# Altium project MCU052A.PrjPcb
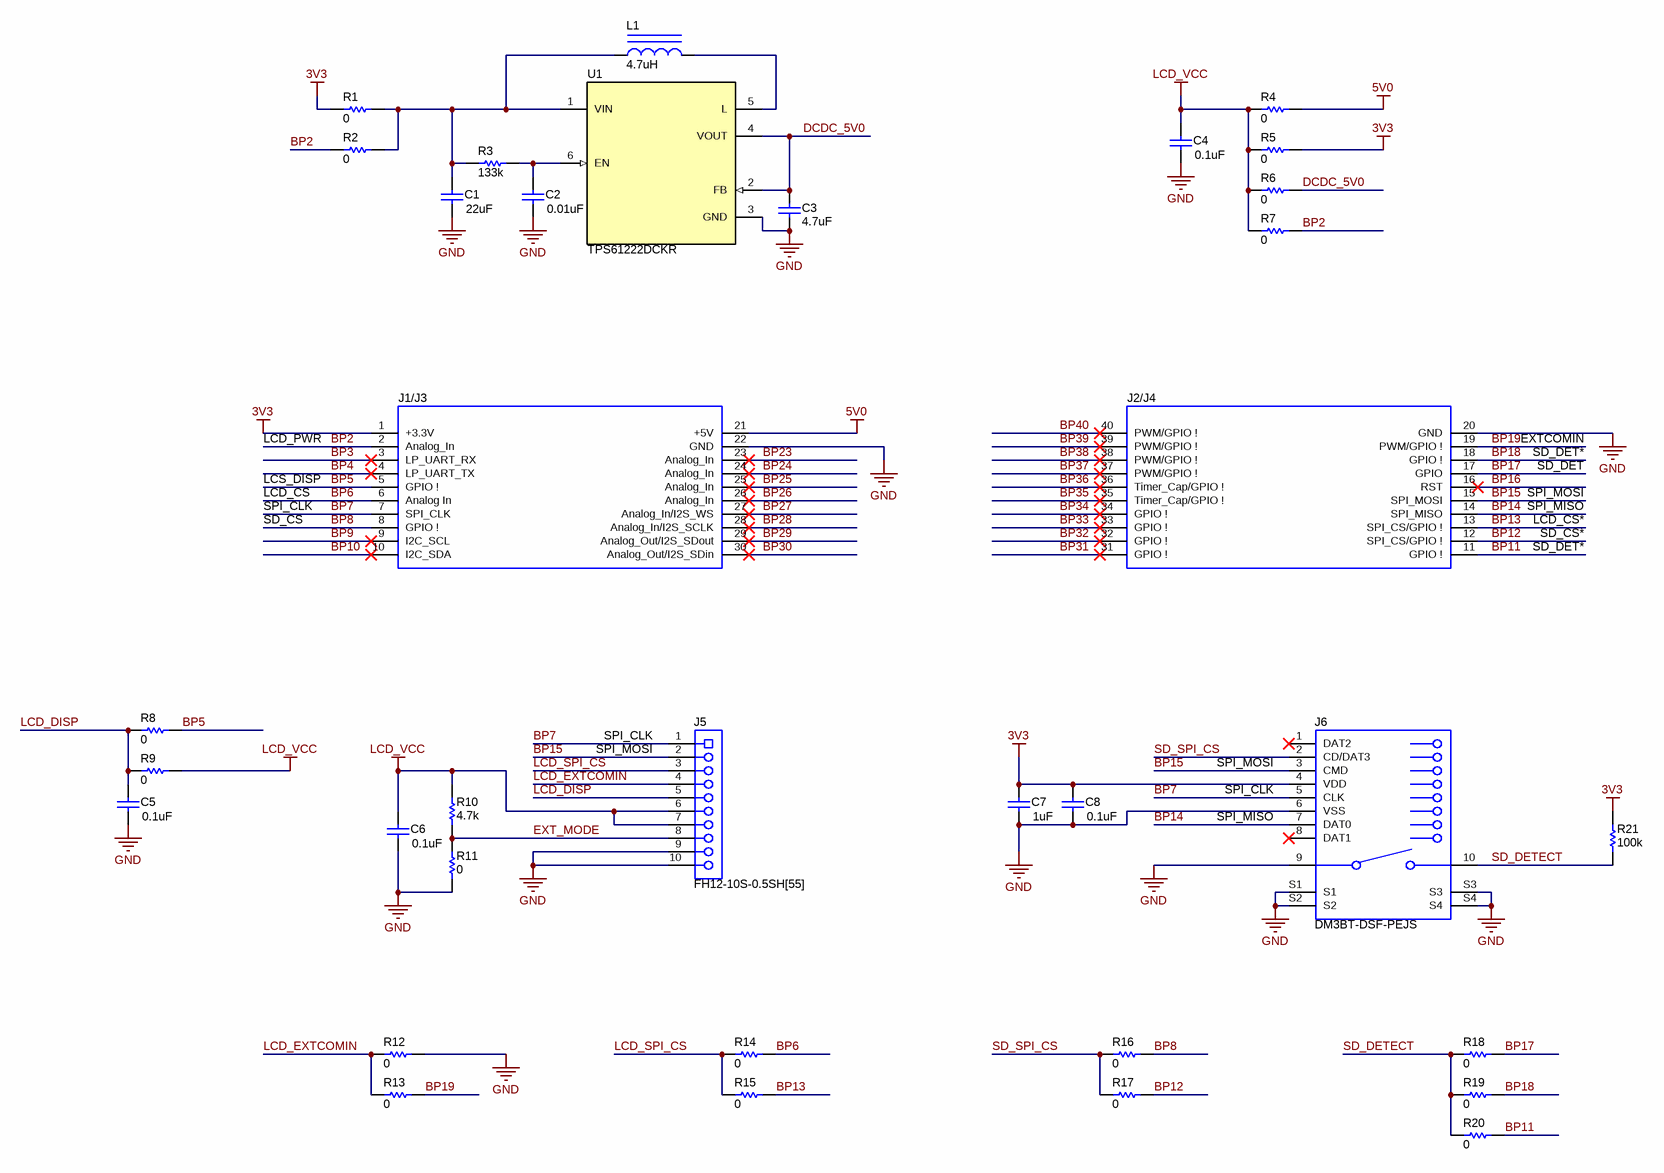
[diagram p0: MCU052A_BOOSTXL-SHARP128.SchDoc]
CopyrightYear: 2018; PCB_Layout: Eric Chen; PCB_Rev: A; PRJ_Customer: Public Release; PRJ_Engineer: Eric Chen; PRJ_Number: MCU052; PRJ_Title: BOOSTXL-SHARP128; SCH_Rev: A; TechSupport: http://www.ti.com/support; TID: N/A
2 sheets, 51 parts. Net scope: global (net labels, ports and power ports of the same name join across sheets).
Board file: MCU052A_PCB.PcbDoc
Sheets:
  MCU052A_BOOSTXL-SHARP128.SchDoc
  MCU052A_EVM_Hardware.SchDoc

## Sheet MCU052A_BOOSTXL-SHARP128.SchDoc
size 431 x 279 mm; Date: Not shown in title block; ApprovedBy: Not shown in title block; CheckedBy: Not shown in title block; Author: Not shown in title block; CompanyName: Not shown in title block; Engineer: Not shown in title block; Organization: Not shown in title block; Address1: Not shown in title block; Address2: Not shown in title block; Address3: Not shown in title block; Address4: Not shown in title block; DocumentNumber: 1; Revision: Use project parameter SCH_Rev; SheetNumber: 1; SheetTotal: 2; PageSetup: Record=PageOptions|CenterHorizontal=True|CenterVertical=True|PrintScale=1.00|XCorrection=1.00|YCorrection=1.00|PrintKind=0|BorderSize=5000000|LeftOffset=0|BottomOffset=0|Orientation=2|PaperLength=1000|PaperWidth=1000|Scale=100|PaperSource=15|PrintQuality=600|MediaType=1|DitherType=10|PaperKind=Letter|PrintScaleMode=1; CurrentTime: Not shown in title block; CurrentDate: Not shown in title block; Time: Not shown in title block; DocumentFullPathAndName: Not shown in title block; DocumentName: Not shown in title block; ModifiedDate: Not shown in title block; ImagePath: Not shown in title block

### Parts
C1  ValueDisplayed: 22uF  [0603]  (hidden comment: GRM188R61A226ME15D)
C2  ValueDisplayed: 0.01uF  [0603]  (hidden comment: GRM188R71E103KA01D)
C3  ValueDisplayed: 4.7uF  [0603]  (hidden comment: GRM188C71A475KE11D)
C4  ValueDisplayed: 0.1uF  [0402]  (hidden comment: GRM155R71A104KA01D)
C5  ValueDisplayed: 0.1uF  [0402]  (hidden comment: GRM155R71A104KA01D)
C6  ValueDisplayed: 0.1uF  [0402]  (hidden comment: GRM155R71A104KA01D)
C7  ValueDisplayed: 1uF  [0603]  (hidden comment: GRM188R71C105KA12D)
C8  ValueDisplayed: 0.1uF  [0402]  (hidden comment: GRM155R71A104KA01D)
J1/J3  SSQ-110-03-T-D  [BoosterPack_40pin_J1J3]  (value not drawn)
J2/J4  SSQ-110-03-T-D  [BoosterPack_40pin_J2J4]  (value not drawn)
J5  FH12-10S-0.5SH[55]  [Hirose_FH12-10S-0_5SH[55]]
J6  DM3BT-DSF-PEJS  [Hirose_DM3BT-DSF-PEJS]
L1  ValueDisplayed: 4.7uH  [EPL3015]  (hidden comment: EPL3015-472MLB)
R1  ValueDisplayed: 0  [0603]  (hidden comment: CRCW06030000Z0EA)
R2  ValueDisplayed: 0  [0603]  (hidden comment: CRCW06030000Z0EA)
R3  ValueDisplayed: 133k  [0603]  (hidden comment: CRCW0603133KFKEA)
R4  ValueDisplayed: 0  [0603]  (hidden comment: CRCW06030000Z0EA)
R5  ValueDisplayed: 0  [0603]  (hidden comment: CRCW06030000Z0EA)
R6  ValueDisplayed: 0  [0603]  (hidden comment: CRCW06030000Z0EA)
R7  ValueDisplayed: 0  [0603]  (hidden comment: CRCW06030000Z0EA)
R8  ValueDisplayed: 0  [0603]  (hidden comment: CRCW06030000Z0EA)
R9  ValueDisplayed: 0  [0603]  (hidden comment: CRCW06030000Z0EA)
R10  ValueDisplayed: 4.7k  [0603]  (hidden comment: CRCW06034K70JNEA)
R11  ValueDisplayed: 0  [0603]  (hidden comment: CRCW06030000Z0EA)
R12  ValueDisplayed: 0  [0603]  (hidden comment: CRCW06030000Z0EA)
R13  ValueDisplayed: 0  [0603]  (hidden comment: CRCW06030000Z0EA)
R14  ValueDisplayed: 0  [0603]  (hidden comment: CRCW06030000Z0EA)
R15  ValueDisplayed: 0  [0603]  (hidden comment: CRCW06030000Z0EA)
R16  ValueDisplayed: 0  [0603]  (hidden comment: CRCW06030000Z0EA)
R17  ValueDisplayed: 0  [0603]  (hidden comment: CRCW06030000Z0EA)
R18  ValueDisplayed: 0  [0603]  (hidden comment: CRCW06030000Z0EA)
R19  ValueDisplayed: 0  [0603]  (hidden comment: CRCW06030000Z0EA)
R20  ValueDisplayed: 0  [0603]  (hidden comment: CRCW06030000Z0EA)
R21  ValueDisplayed: 100k  [0603]  (hidden comment: CRCW0603100KFKEA)
U1  TPS61222DCKR  [DCK0006A_N]

### Nets
3V3: C7.1 C8.1 J1/J3.1(+3.3V) J6.4(VDD) R1.1 R5.2 R21.2
5V0: J1/J3.21(+5V) R4.2
GND: C1.2 C2.2 C3.2 C4.2 C5.2 C6.2 C7.2 C8.2 J1/J3.22(GND) J2/J4.20(GND) J5.9 J5.10 J6.6(VSS) J6.9(A) J6.S1 J6.S2 J6.S3 J6.S4 R11.1 R12.2 U1.3(GND)
LCD_VCC: C4.1 C6.1 J5.6 J5.7 R4.1 R5.1 R6.1 R7.1 R9.2 R10.2
BP2: J1/J3.2(Analog_In) R2.1 R7.2
BP3: J1/J3.3(LP_UART_RX)
BP4: J1/J3.4(LP_UART_TX)
BP5: J1/J3.5(GPIO_!) R8.2
BP6: J1/J3.6(Analog_In) R14.2
BP7: J1/J3.7(SPI_CLK) J5.1 J6.5(CLK)
BP8: J1/J3.8(GPIO_!) R16.2
BP9: J1/J3.9(I2C_SCL)
BP10: J1/J3.10(I2C_SDA)
BP11: J2/J4.11(GPIO_!) R20.2
BP12: J2/J4.12(SPI_CS/GPIO_!) R17.2
BP13: J2/J4.13(SPI_CS/GPIO_!) R15.2
BP14: J2/J4.14(SPI_MISO) J6.7(DAT0)
BP15: J2/J4.15(SPI_MOSI) J5.2 J6.3(CMD)
BP16: J2/J4.16(RST)
BP17: J2/J4.17(GPIO) R18.2
BP18: J2/J4.18(GPIO_!) R19.2
BP19: J2/J4.19(PWM/GPIO_!) R13.2
BP23: J1/J3.23(Analog_In)
BP24: J1/J3.24(Analog_In)
BP25: J1/J3.25(Analog_In)
BP26: J1/J3.26(Analog_In)
BP27: J1/J3.27(Analog_In/I2S_WS)
BP28: J1/J3.28(Analog_In/I2S_SCLK)
BP29: J1/J3.29(Analog_Out/I2S_SDout)
BP30: J1/J3.30(Analog_Out/I2S_SDin)
BP31: J2/J4.31(GPIO_!)
BP32: J2/J4.32(GPIO_!)
BP33: J2/J4.33(GPIO_!)
BP34: J2/J4.34(GPIO_!)
BP35: J2/J4.35(Timer_Cap/GPIO_!)
BP36: J2/J4.36(Timer_Cap/GPIO_!)
BP37: J2/J4.37(PWM/GPIO_!)
BP38: J2/J4.38(PWM/GPIO_!)
BP39: J2/J4.39(PWM/GPIO_!)
BP40: J2/J4.40(PWM/GPIO_!)
DCDC_5V0: C3.1 R6.2 U1.2(FB) U1.4(VOUT)
EXT_MODE: J5.8 R10.1 R11.2
LCD_DISP: C5.1 J5.5 R8.1 R9.1
LCD_EXTCOMIN: J5.4 R12.1 R13.1
LCD_SPI_CS: J5.3 R14.1 R15.1
SD_DETECT: J6.10(B) R18.1 R19.1 R20.1 R21.1
SD_SPI_CS: J6.2(CD/DAT3) R16.1 R17.1
NetC1_1: C1.1 L1.1 R1.2 R2.2 R3.1 U1.1(VIN)
NetC2_1: C2.1 R3.2 U1.6(EN)
NetL1_2: L1.2 U1.5(L)

Not connected (* = marked no-connect by the designer): J6 1(DAT2)* 8(DAT1)*

### Notes on the sheet
- LCD_PWR
- SD_DET*
- EXTCOMIN
- SPI_CLK
- LCD_CS
- SD_CS
- LCS_DISP
- SPI_MISO
- SPI_MOSI
- LCD_CS*
- SD_DET
- SD_CS*
- (near J5) SPI_CLK
- (near J5) SPI_MOSI
- (near J6) SPI_MOSI
- (near J6) SPI_CLK
- (near J6) SPI_MISO
- Drawn By:
- SVN Rev:
- Number:
- TID #:
- Orderable:
- Rev:
- Sheet Title:
- File:
- Project Title:
- Designed for:
- Assembly Variant:
- Mod. Date:
- Sheet:
- Size:
- of
- B
- http://www.ti.com
- Texas Instruments and/or its licensors do not warrant the accuracy or completeness of this specification or any information contained therein. Texas Instruments and/or its licensors do not warrant that this design will meet the specifications, will be suitable for your application or fit for any particular purpose, or will operate in an implementation. Texas Instruments and/or its licensors do not warrant that the design is production worthy. You should completely validate and test your design implementation to confirm the system functionality for your application.
- Engineer:
- Contact:
- © Texas Instruments

### Library data of the parts
C1 = CMP-0007324-5: CAP, CERM, 22 uF, 10 V, +/- 20%, X5R, 0603; Manufacturer: MuRata; TaMin_C: -55°C; Polarized: N; SizeAreaWB_mm2: 4.68; Value1: Unknown; U/M: EA; Value: 22uF; TaMax_C: 85°C; SizeZ_mm: 1; SizeX_mm: 1.6; SizeY_mm: 0.8; Value2: 10V; SizeArea_mm2: 1.28; Cap_F: 22µF; AEC Category: Q200; Supplier Part Number 2: 68X2786; Publisher: Texas Instruments; Supplier 2: Newark; Supplier Part Number 3: 81-GRM188R61A226ME5D; TempCo: X5R; Supplier 3: Mouser; Published: 2008-06-19; RoHS: Y; MountType: SMT; Supplier 1: Digi-Key; PackageReference: 0603; Tolerance_%: 20%; Cap_Case: 0603; CompType: Capacitor; LatestRevisionDate: 2017-03-09; PartNumber: GRM188R61A226ME15D; AEC Qualified: ?; VDC_V: 10V; ComponentLink1Description: Datasheet link; Supplier Part Number 1: 490-10476-1-ND; Technology: Ceramic; ComponentLink1URL: http://psearch.murata.com/capacitor/product/GRM188R61A226ME15%23.pdf
C2 = CMP-0007403-4: CAP, CERM, 0.01 uF, 25 V, +/- 10%, X7R, 0603; Manufacturer: MuRata; TaMin_C: -55°C; Polarized: N; SizeAreaWB_mm2: 4.68; Value1: Unknown; U/M: EA; Value: 0.01uF; TaMax_C: 125°C; SizeZ_mm: 1; SizeX_mm: 1.6; SizeY_mm: 0.8; Value2: 25V; SizeArea_mm2: 1.28; Cap_F: 10nF; AEC Category: Q200; Supplier Part Number 2: 81-GRM39X103K25; Publisher: Texas Instruments; Supplier 2: Mouser; TempCo: X7R; Published: 2008-06-19; RoHS: Y; MountType: SMT; Supplier 1: Digi-Key; PackageReference: 0603; Tolerance_%: 10%; Cap_Case: 0603; CompType: Capacitor; LatestRevisionDate: 2017-03-09; PartNumber: GRM188R71E103KA01D; AEC Qualified: ?; ComponentLink1Description: Datasheet link; Supplier Part Number 1: 490-1520-1-ND; Technology: Ceramic; ComponentLink1URL: http://search.murata.co.jp/Ceramy/PnsearchViewAction.do?HnOFG=ON&HnNFG=ON&SEL_CNT=50&sLang=en&sKey=GRM188R71E103KA01D&x=9&y=9&search=startwith
C3 = CMP-0007291-4: CAP, CERM, 4.7 uF, 10 V, +/- 10%, X7S, 0603; Manufacturer: MuRata; TaMin_C: -55°C; Polarized: N; SizeAreaWB_mm2: 4.68; Value1: Unknown; U/M: EA; Value: 4.7uF; TaMax_C: 125°C; SizeZ_mm: 1; SizeX_mm: 1.6; SizeY_mm: 0.8; Value2: 10V; SizeArea_mm2: 1.28; Cap_F: 4.7µF; AEC Category: Q200; Supplier Part Number 2: 81-GRM188C71A475KE1D; Publisher: Texas Instruments; Supplier 2: Mouser; TempCo: X7S; Published: 2008-06-19; RoHS: Y; MountType: SMT; Supplier 1: Digi-Key; PackageReference: 0603; Tolerance_%: 10%; Cap_Case: 0603; CompType: Capacitor; LatestRevisionDate: 2017-03-09; PartNumber: GRM188C71A475KE11D; AEC Qualified: N; VDC_V: 10V; ComponentLink1Description: Datasheet link; AEC Grade: N/A; Supplier Part Number 1: 490-11992-1-ND; Technology: Ceramic; ComponentLink1URL: http://search.murata.co.jp/Ceramy/image/img/A01X/G101/ENG/GRM188C71A475KE11-01.pdf
C4-C6 C8 = CMP-0006629-2: CAP, CERM, 0.1 uF, 10 V, +/- 10%, X7R, 0402; Manufacturer: MuRata; TaMin_C: -55°C; Polarized: N; SizeAreaWB_mm2: 3; Value1: Unknown; U/M: EA; Value: 0.1uF; TaMax_C: 125°C; SizeZ_mm: 0.6; SizeX_mm: 1; SizeY_mm: 0.5; Value2: 10V; Cap_F: 100nF; AEC Category: Q200; Supplier Part Number 2: 14T3278; Publisher: Texas Instruments; Supplier 2: Newark; Supplier Part Number 3: 81-GRM155R71A104KA1D; TempCo: X7R; Supplier 3: Mouser; Published: 2008-06-19; RoHS: Y; MountType: SMT; Supplier 1: Digi-Key; PackageReference: 0402; Tolerance_%: 10%; Cap_Case: 0402; SizeArea_mm2: 0.5; CompType: Capacitor; LatestRevisionDate: 2017-03-09; PartNumber: GRM155R71A104KA01D; AEC Qualified: ?; ComponentLink1Description: Datasheet link; Supplier Part Number 1: GRM155R71A104KA01D-ND; Technology: Ceramic; ComponentLink1URL: http://search.murata.co.jp/Ceramy/PnsearchViewAction.do?HnOFG=ON&HnNFG=ON&SEL_CNT=50&sLang=en&sKey=GRM155R71A104KA01D&x=9&y=9&search=startwith
C7 = CMP-0007379-4: CAP, CERM, 1 uF, 16 V, +/- 10%, X7R, 0603; Manufacturer: MuRata; TaMin_C: -55°C; ESR_ohm: 0.011; Polarized: N; SizeAreaWB_mm2: 4.68; Value1: 0.011 ohm; U/M: EA; Value: 1uF; TaMax_C: 125°C; SizeZ_mm: 1; SizeX_mm: 1.6; SizeY_mm: 0.8; Value2: 16V; SizeArea_mm2: 1.28; Cap_F: 1µF; AEC Category: Q200; Supplier Part Number 2: 81-GRM188R71C105KA12; Publisher: Texas Instruments; Supplier 2: Mouser; Supplier Part Number 3: 1828826; TempCo: X7R; Supplier 3: Farnell; Published: 2008-06-19; RoHS: Y; MountType: SMT; Supplier 1: Digi-Key; PackageReference: 0603; Tolerance_%: 10%; Cap_Case: 0603; CompType: Capacitor; LatestRevisionDate: 2017-03-09; PartNumber: GRM188R71C105KA12D; AEC Qualified: ?; VDC_V: 16V; ComponentLink1Description: Datasheet link; Supplier Part Number 1: 490-3900-1-ND; Technology: Ceramic; ComponentLink1URL: http://search.murata.co.jp/Ceramy/PnsearchViewAction.do?HnOFG=ON&HnNFG=ON&SEL_CNT=50&sLang=en&sKey=GRM188R71C105KA12D&x=9&y=9&search=startwith
J1/J3 = CMP-0003837-2: Receptacle, 2.54mm, 10x2, Tin, TH; Alternate PartNumber: CRD-081413-A-G; Manufacturer: Samtec; Alternate Manufacturer: Major League Electronics; Note: Booster Pack 40 pin J1 and J3; Green_Lifecycle: Active; Green_REACh: Incomplete; Supplier 1: Digi-Key; CompType: Receptacle; PackageReference: 10x2 Receptacle; RoHS: Y; Supplier Part Number 1: SAM1204-10-ND; MountType: TH; PartNumber: SSQ-110-03-T-D; ComponentLink1Description: Datasheet Link; ComponentLink1URL: https://www.samtec.com/ftppub/cpdf/SSQ-1XX-XX-XXX-X-XX-XXX-XX-X-MKT.pdf; Supplier 2: Newark; Supplier Part Number 2: 11P8392; Green_EU RoHS: Passed; Green_EU RoHS-2: Passed
J2/J4 = CMP-0078266-2: Receptacle, 2.54mm, 10x2, Tin, TH; Alternate PartNumber: CRD-081413-A-G; Manufacturer: Samtec; Alternate Manufacturer: Major League Electronics; Note: Booster Pack 40 pin J2 and J4; Green_REACh: Incomplete; Green_Lifecycle: Active; Green_EU RoHS-2: Passed; CompType: Receptacle; Supplier 1: Digi-Key; PackageReference: 10x2 Receptacle; RoHS: Y; Supplier Part Number 1: SAM1204-10-ND; PartNumber: SSQ-110-03-T-D; MountType: TH; ComponentLink1Description: Datasheet Link; Green_EU RoHS: Passed; ComponentLink1URL: https://www.samtec.com/ftppub/cpdf/SSQ-1XX-XX-XXX-X-XX-XXX-XX-X-MKT.pdf; Supplier 2: Newark; Supplier Part Number 2: 11P8392
J5 = CMP-0075009-2: Connector, FPC 10 Pos. 9.1x2.0x5.6 mm; PartNumber: FH12-10S-0.5SH(55); Manufacturer: Hirose Electric Co. Ltd.; CompType: FFC or FPC; CNHeader: False; CT: True; ComponentLink1URL: http://www.hirose.co.jp/cataloge_hp/e58605370.pdf; ComponentLink1Description: Datasheet URL; Supplier 1: Digi-Key; Supplier Part Number 1: HFJ110CT-ND; LatestRevisionDate: 2017-07-12; Publisher: Texas Instruments; RoHS: Y; PackageReference: Connector PFC, 9.1x2.0x5.6mm; MountType: SMT; Supplier 2: Mouser; Supplier Part Number 2: 798-FH12-10S-0.5SH55
J6 = CMP-0080007-1: Conncetor, micro SD, 8+2 Pos, R/A, SMT; Manufacturer: Hirose Electric Co. Ltd.; Pitch_mm: 1.1; Gender: Female; ContactFinish: Gold; Row_Count: 1; CompType: Connector; ComponentLink1Description: Datasheet URL; RoHS: Y; Supplier Part Number 3: 798-DM3BT-DSF-PEJS; Supplier 1: Digi-Key; Orientation: R/A; PackageReference: Conncetor, micro SD, 8+2 Pos, R/A, SMT; PartNumber: DM3BT-DSF-PEJS; PinCount: 10; Supplier Part Number 2: 35R0580; Supplier 2: Newark; ComponentLink1URL: https://www.hirose.com/product/en/download_file/key_name/DM3/category/Catalog/doc_file_id/49662/?file_category_id=4&item_id=195&is_series=1; Supplier Part Number 1: HR1942CT-ND; MountType: SMT; Supplier 3: Mouser
L1 = CMP-0060351-1: Inductor, Shielded, Ferrite, 4.7 uH, 1.2 A, 0.14 ohm, SMD; Manufacturer: Coilcraft; Isat: 1.2A @ 30% inductance drop; Irms: 1.4A @ 40C rise; Green_Lifecycle: Not Set; SizeAreaWB_mm2: 16; DCR_ohm: 1.4d; Green_REACh: Incomplete; Value: 4.7uH; Imax_A: 1.2A; SizeZ_mm: 1.55; SizeX_mm: 3; SizeArea_mm2: 9; Ind_H: 4.7µH; AEC Category: Q200; ComponentLink1URL: http://www.coilcraft.com/pdfs/epl3015.pdf; Supplier Part Number 2: 2287412; Publisher: Texas Instruments; Supplier 2: Farnell; Published: 2008-06-26; RoHS: Y; Value1: 0.14 ohm; Material: Ferrite; MountType: SMT; Green_EU RoHS-2: Incomplete; Supplier 1: Mouser; Green_EU RoHS: Incomplete; PackageReference: Inductor, 3x1.55x3mm; SizeY_mm: 3; Value2: 1.2A; CompType: Inductor; LatestRevisionDate: 2017-06-02; PartNumber: EPL3015-472MLB; AEC Qualified: ?; ComponentLink1Description: Datasheet link; Supplier Part Number 1: 994-EPL3015-472MLB; Technology: Shielded
R1 R2 R4-R9 R11-R20 = CMP-0025697-4: RES, 0, 5%, 0.1 W, AEC-Q200 Grade 0, 0603; Manufacturer: Vishay-Dale; Power_W: 100mW; TempCo: 200 ppm/C; Value_Code: 0000; Value: 0; EIA_Code: E24; SizeX_mm: 1.6; SizeY_mm: 0.8; SizeZ_mm: 1; Value2: 0.1W; SizeArea_mm2: 1.28; AEC Qualified: Y; VDC_V: 75V; AEC Category: Q200; Supplier Part Number 2: 52K8014; Supplier 2: Newark; Supplier Part Number 3: 71-CRCW0603-0-E3; Supplier 3: Mouser; RoHS: E; Value1: 5%; MountType: SMT; Supplier 1: Digi-Key; PackageReference: 0603; Tolerance_%: 5%; Res_ohm: 0; CompType: Resistor; PartNumber: CRCW06030000Z0EA; ComponentLink1Description: Datasheet link; Supplier Part Number 1: 541-0.0GCT-ND; Technology: Thick Film; ComponentLink1URL: http://www.vishay.com/docs/20035/dcrcwe3.pdf; AEC Grade: 0
R3 = CMP-0022038-4: RES, 133 k, 1%, 0.1 W, AEC-Q200 Grade 0, 0603; Manufacturer: Vishay-Dale; Power_W: 100mW; TempCo: 100 ppm/C; Value: 133k; EIA_Code: E96; SizeX_mm: 1.6; SizeY_mm: 0.8; SizeZ_mm: 1; Value2: 0.1W; SizeArea_mm2: 1.28; AEC Qualified: Y; VDC_V: 75V; AEC Category: Q200; AEC Grade: 0; Supplier Part Number 2: 52K8129; Supplier 2: Newark; Supplier Part Number 3: 71-CRCW0603-133K-E3; Supplier 3: Mouser; Value_Code: 133k; RoHS: E; Value1: 1%; MountType: SMT; Supplier 1: Digi-Key; PackageReference: 0603; Tolerance_%: 1%; Res_ohm: 133k; CompType: Resistor; PartNumber: CRCW0603133KFKEA; ComponentLink1Description: Datasheet link; Supplier Part Number 1: 541-133KHCT-ND; Technology: Thick Film; ComponentLink1URL: http://www.vishay.com/docs/20035/dcrcwe3.pdf
R10 = CMP-0025817-4: RES, 4.7 k, 5%, 0.1 W, AEC-Q200 Grade 0, 0603; Manufacturer: Vishay-Dale; Power_W: 100mW; TempCo: 200 ppm/C; Value_Code: 4k70; Value: 4.7k; EIA_Code: E24; SizeX_mm: 1.6; SizeY_mm: 0.8; SizeZ_mm: 1; Value2: 0.1W; SizeArea_mm2: 1.28; AEC Qualified: Y; VDC_V: 75V; AEC Category: Q200; AEC Grade: 0; Supplier Part Number 2: 59M6811; Supplier 2: Newark; Supplier Part Number 3: 71-CRCW0603J-4.7K-E3; Supplier 3: Mouser; RoHS: E; Value1: 5%; MountType: SMT; Supplier 1: Digi-Key; PackageReference: 0603; Tolerance_%: 5%; Res_ohm: 4.7k; CompType: Resistor; PartNumber: CRCW06034K70JNEA; ComponentLink1Description: Datasheet link; Supplier Part Number 1: 541-4.7KGCT-ND; Technology: Thick Film; ComponentLink1URL: http://www.vishay.com/docs/20035/dcrcwe3.pdf
R21 = CMP-0021990-4: RES, 100 k, 1%, 0.1 W, AEC-Q200 Grade 0, 0603; Manufacturer: Vishay-Dale; Power_W: 100mW; TempCo: 100 ppm/C; Value: 100k; EIA_Code: E96; SizeX_mm: 1.6; SizeY_mm: 0.8; SizeZ_mm: 1; Value2: 0.1W; SizeArea_mm2: 1.28; CompType: Resistor; AEC Qualified: Y; VDC_V: 75V; AEC Category: Q200; AEC Grade: 0; Supplier Part Number 2: 42K3668; Supplier 2: Newark; Supplier Part Number 3: 71-CRCW0603-100K-E3; Supplier 3: Mouser; Value_Code: 100k; RoHS: E; Value1: 1%; MountType: SMT; Supplier 1: Digi-Key; PackageReference: 0603; Tolerance_%: 1%; Res_ohm: 100k; PartNumber: CRCW0603100KFKEA; ComponentLink1Description: Datasheet link; Supplier Part Number 1: 541-100KHCT-ND; Technology: Thick Film; ComponentLink1URL: http://www.vishay.com/docs/20035/dcrcwe3.pdf
U1 = CMP-0067206-3: Tiny Low Input Voltage Boost Converter, DCK0006A (SOT-SC70-6); Alternate PartNumber: TPS61222DCKT; Manufacturer: Texas Instruments; SizeZ_mm: 1.1; SizeX_mm: 2.1; SizeY_mm: 2.0; SizeArea_mm2: 4.2; CompType: IC; SizeAreaWB_mm2: 9.3; AEC Category: Q200; AEC Qualified: N; ComponentLink1URL: http://www.ti.com/lit/ds/symlink/tps61222.pdf; PackageDescription: SOT-SC70-6; PackageReference: DCK0006A; RoHS: Y; MountType: SMT; PartNumber: TPS61222DCKR; Alternate Manufacturer: Texas Instruments; ComponentLink1Description: Datasheet Link; ComponentLink2Description: Product Folder; ComponentLink2URL: http://www.ti.com/product/tps61222; ComponentLink3Description: Online Datasheet; ComponentLink3URL: http://www.ti.com/product/tps61222/datasheet

## Sheet MCU052A_EVM_Hardware.SchDoc
size 431 x 279 mm; Date: Not shown in title block; ApprovedBy: Not shown in title block; CheckedBy: Not shown in title block; Author: Not shown in title block; CompanyName: Not shown in title block; Engineer: Not shown in title block; Organization: Not shown in title block; Address1: Not shown in title block; Address2: Not shown in title block; Address3: Not shown in title block; Address4: Not shown in title block; DocumentNumber: 1; Revision: Use project parameter SCH_Rev; SheetNumber: 2; SheetTotal: 2; PageSetup: Record=PageOptions|CenterHorizontal=True|CenterVertical=True|PrintScale=1.00|XCorrection=1.00|YCorrection=1.00|PrintKind=0|BorderSize=5000000|LeftOffset=0|BottomOffset=0|Orientation=2|PaperLength=1000|PaperWidth=1000|Scale=100|PaperSource=15|PrintQuality=600|MediaType=1|DitherType=10|PaperKind=Letter|PrintScaleMode=1; CurrentTime: Not shown in title block; CurrentDate: Not shown in title block; Time: Not shown in title block; DocumentFullPathAndName: Not shown in title block; DocumentName: Not shown in title block; ModifiedDate: Not shown in title block; ImagePath: Not shown in title block
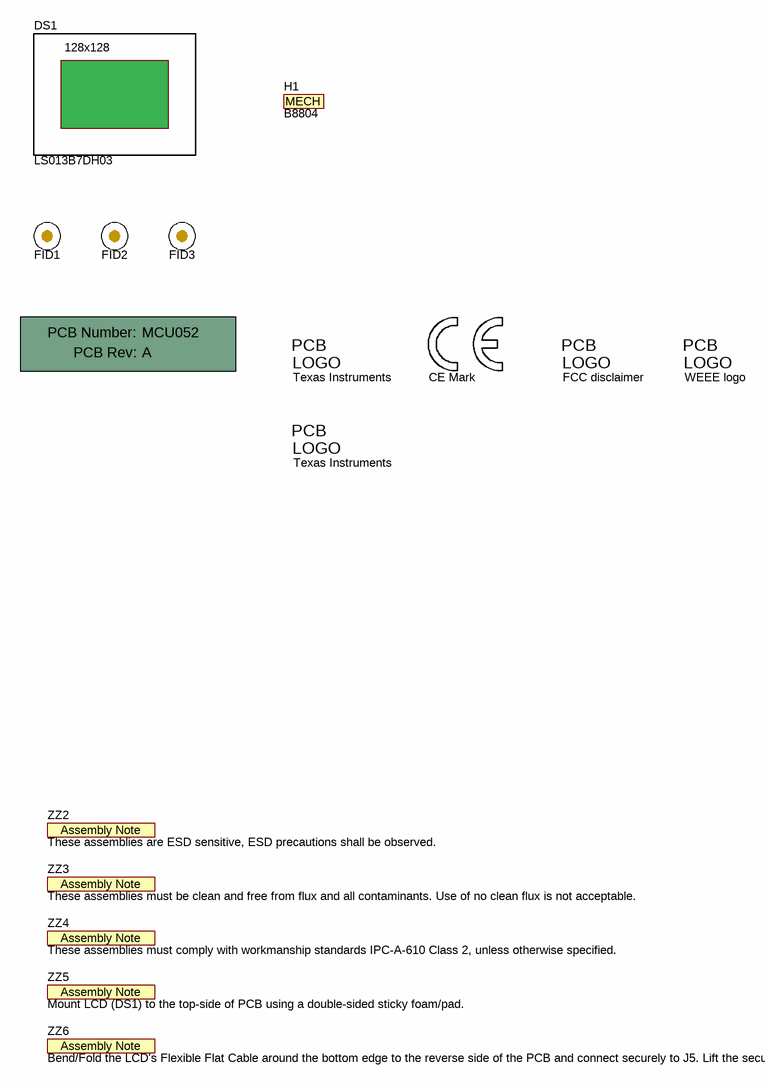
[diagram p1: MCU052A_EVM_Hardware.SchDoc]

### Parts
!PCB1  Printed Circuit Board  (value not drawn)  (mechanical)
DS1  LS013B7DH03  [Sharp_LS013B7DH03]
FID1  Fiducial  [Fiducial10-20]  (value not drawn)
FID2  Fiducial  [Fiducial10-20]  (value not drawn)
FID3  Fiducial  [Fiducial10-20]  (value not drawn)
H1  B8804  (mechanical)
Logo1  CE Mark  [CE_Mark_5mm]  (no BOM)
Logo2  Texas Instruments  [TI_Symbol_Overlay_Small]  (no BOM)
Logo3  FCC disclaimer  [FCC_disclaimer_stacked]  (no BOM)
Logo4  WEEE logo  [WEEE_Minimum]  (no BOM)
Logo5  Texas Instruments  [TI_Stacked_Overlay_Small_Vertical]  (no BOM)
ZZ2  These assemblies are ESD sensitive, ESD precautions shall be observed.  [AssemblyNote]  (no BOM)
ZZ3  These assemblies must be clean and free from flux and all contaminants. Use of no clean flux is not acceptable.  [AssemblyNote]  (no BOM)
ZZ4  These assemblies must comply with workmanship standards IPC-A-610 Class 2, unless otherwise specified.  [AssemblyNote]  (no BOM)
ZZ5  Mount LCD (DS1) to the top-side of PCB using a double-sided sticky foam/pad.  [AssemblyNote]  (no BOM)
ZZ6  Bend/Fold the LCD's Flexible Flat Cable around the bottom edge to the reverse side of the PCB and connect securely to J5. Lift the securing tab on J5 vertically, insert the LCD flex cable, and push the securing tab down until a tactile click.  [AssemblyNote]  (no BOM)

### Notes on the sheet
- Drawn By:
- SVN Rev:
- Number:
- TID #:
- Orderable:
- Rev:
- Sheet Title:
- File:
- Project Title:
- Designed for:
- Assembly Variant:
- Mod. Date:
- Sheet:
- Size:
- of
- B
- http://www.ti.com
- Texas Instruments and/or its licensors do not warrant the accuracy or completeness of this specification or any information contained therein. Texas Instruments and/or its licensors do not warrant that this design will meet the specifications, will be suitable for your application or fit for any particular purpose, or will operate in an implementation. Texas Instruments and/or its licensors do not warrant that the design is production worthy. You should completely validate and test your design implementation to confirm the system functionality for your application.
- Engineer:
- Contact:
- © Texas Instruments
- (in symbol CMP-0003618-2) PCB Number:; PCB Rev:
- (in symbol CMP-0067626-1) 128x128
- (in symbol CMP-0074769-1) PCB; LOGO
- (in symbol CMP-0074838-1) PCB; LOGO
- (in symbol CMP-0074847-1) PCB; LOGO
- (in symbol CMP-0077236-1) Assembly Note
- (in symbol CMP-0080604-2) MECH

### Library data of the parts
!PCB1 = CMP-0003618-2: Manufacturer: Any; PartNumber: MCU052; CompType: PCB; RoHS: O; MountType: N/A; Publisher: Texas Instruments; LatestRevisionDate: 2017-03-09; Key: PCB
DS1 = CMP-0067626-1: LCD Display Dot Pixels 128x128; Manufacturer: Sharp Microelectronics; CompType: LCD Module; ComponentLink1URL: https://sps06.itg.ti.com/sites/KMS/crossdivteams/altium/docs/ComponentDatasheets/LS013B7DH03_Spec.pdf; Key: LS013B7DH03; Publisher: Texas Instruments; Supplier Part Number 2: 852-LS013B7DH03; Supplier 1: Digi-Key; PackageReference: LCD Display Dot Pixels 128x128; LatestRevisionDate: 2017-06-05; RoHS: Y; Supplier Part Number 1: 425-2903-ND; MountType: N/A; Supplier 2: Mouser; PartNumber: LS013B7DH03; ComponentLink1Description: Datasheet Link
FID1-FID3 = CMP-0077181-1: Fiducial mark.  There is nothing to buy or mount.; CompType: Fiducial; Manufacturer: N/A; MountType: N/A; PackageReference: N/A; PartNumber: N/A; ClassName: FiducialMark; Library Reference: Fiducial
H1 = CMP-0080604-2: 1mm Thick, Doublesided Adhesive EVA Foam Pad (cut into 20mm x 20mm square pieces); Manufacturer: ZHEJIANG XINHENGTAI ADVANCED MATERIAL CO., LTD; Alternate PartNumber: 5952 3/4"X15YD; Alternate Manufacturer: 3M; CompType: Mechanical; RoHS: PASS; PartNumber: B8804
Logo1 = CMP-0074844-1: SymbolCreator: a0412235; Published: 2009-03-03; Publisher: Texas Instruments; LatestRevisionDate: 2017-07-06; Lib Reference: CE Mark; PartNumber: CE Mark; Library Reference: CE Mark
Logo2 = CMP-0074838-1: Texas Instrument Corporate Signature; SymbolCreator: a0412235; Lib Reference: TI_Logo; Library Reference: Logo; SymbolVersion: 2011-08-22; Published: 2009-03-03; Publisher: Texas Instruments; ClassName: Logo; LatestRevisionDate: 2017-07-06; PartNumber: Texas Instruments
Logo3 = CMP-0074847-1: FCC_disclaimer; Library Reference: Logo; Published: 2009-03-03; Publisher: Texas Instruments; LatestRevisionDate: 2017-07-06; Lib Reference: FCC_disclaimer; PartNumber: FCC disclaimer
Logo4 = CMP-0074769-1: Library Reference: WEEE logo; Lib Reference: WEEE logo; PartNumber: WEEE logo
Logo5 = CMP-0074838-1: Texas Instrument Corporate Signature; Library Reference: Logo; SymbolCreator: a0412235; Lib Reference: TI_Logo; ClassName: Logo; Publisher: Texas Instruments; SymbolVersion: 2011-08-22; Published: 2009-03-03; LatestRevisionDate: 2017-07-06; PartNumber: Texas Instruments
ZZ2 ZZ5 ZZ6 = CMP-0077236-1: CompType: AssemblyNote; ClassName: AssemblyNote; Publisher: Texas Instruments; LatestRevisionDate: 2017-08-10; Key: AssemblyNote
ZZ3 = CMP-0077237-1: CompType: AssemblyNote; ClassName: AssemblyNote; Publisher: Texas Instruments; LatestRevisionDate: 2017-08-10; Key: AssemblyNote
ZZ4 = CMP-0077238-1: CompType: AssemblyNote; ClassName: AssemblyNote; Publisher: Texas Instruments; LatestRevisionDate: 2017-08-10; Key: AssemblyNote

## Assembly variants
001: not fitted FID1 FID2 FID3 R1 R2 R4 R5 R6 R9 R10 R13 R15 R17 R19 R20 R21